# Altium project usb_to_ttl.PrjPcb
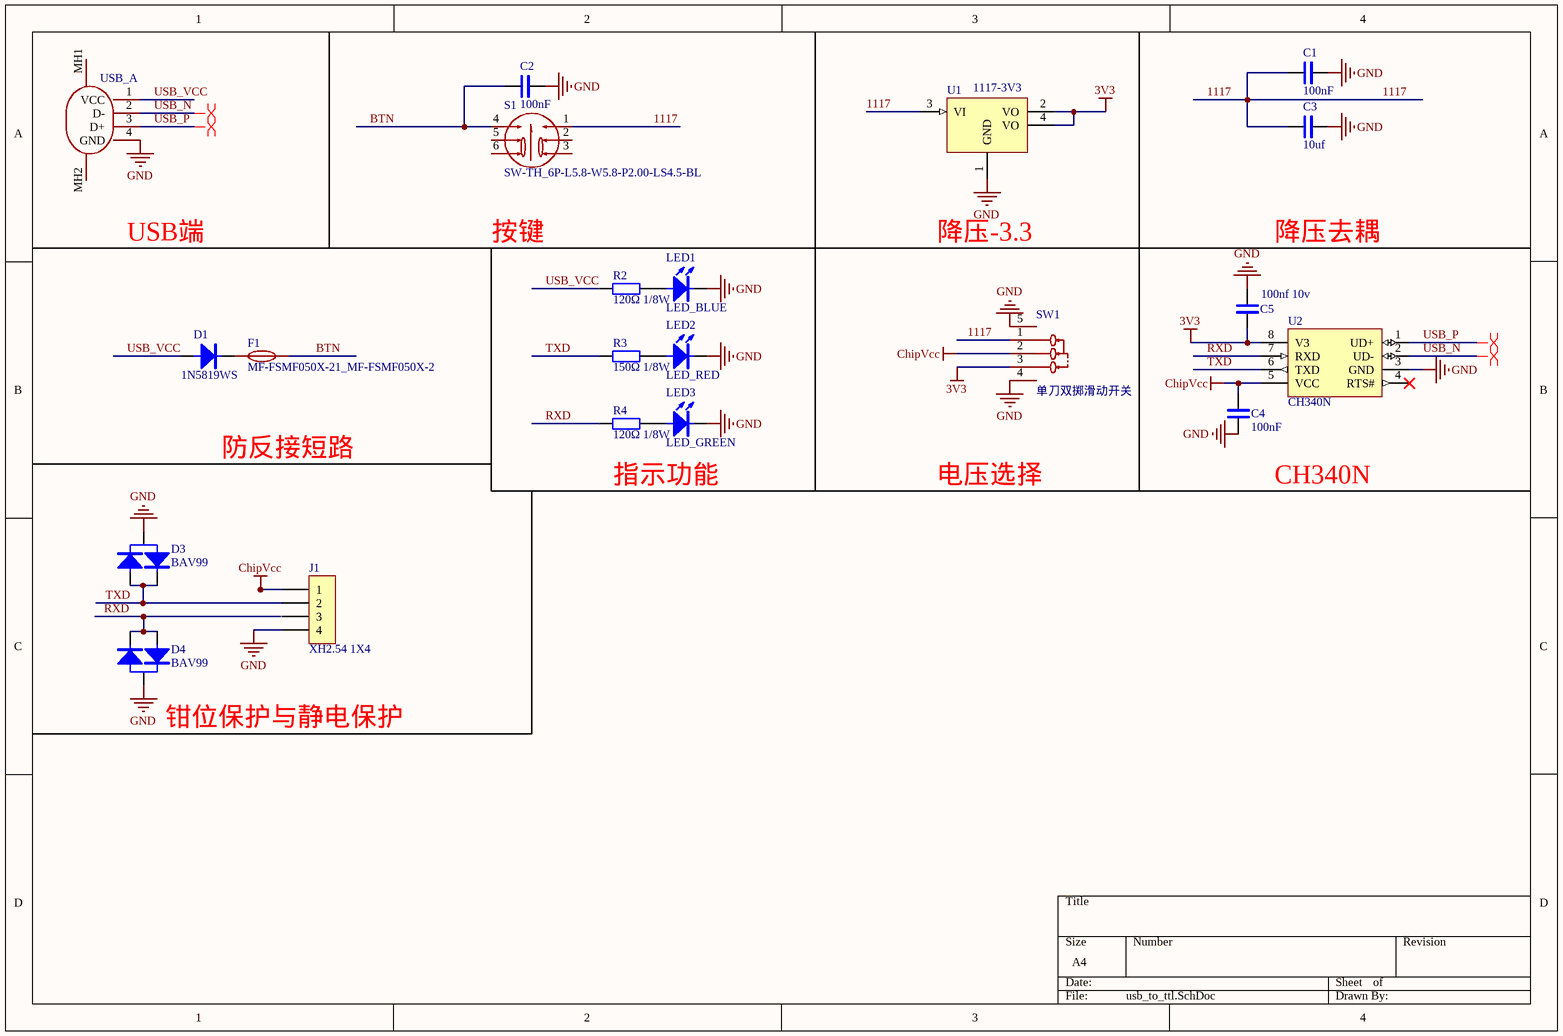
[diagram p0: usb_to_ttl.SchDoc]
1 sheet, 21 parts. Net scope: global (net labels, ports and power ports of the same name join across sheets).
Board file: usb_to_ttl.PcbDoc

## Sheet usb_to_ttl.SchDoc
size A4; SheetNumber: 1; SheetTotal: 1

### Parts
C1  100nF  [CAP-0402]
C2  100nF  [CAP-0402]
C3  10uf  [CAP-0603]
C4  100nF  [CAP-0402]
C5  100nf 10v  [CAP-0402]
D1  1N5819WS  [SOD-323]
D3  BAV99  [SOT-23-3]
D4  BAV99  [SOT-23-3]
F1  MF-FSMF050X-21_MF-FSMF050X-2  [F0603]
J1  XH2.54 1X4  [PIN-4-2.54-1.0]
LED1  LED_BLUE  [LED-D5]
LED2  LED_RED  [LED-0603]
LED3  LED_GREEN  [LED-0603]
R2  120Ω 1/8W  [RES-0805]
R3  150Ω 1/8W  [RES-0805]
R4  120Ω 1/8W  [RES-0805]
S1  SW-TH_6P-L5.8-W5.8-P2.00-LS4.5-BL  [KFC5858-Z]
SW1  单刀双掷滑动开关  [SW-TH_SK12D07VG5-1]
U1  1117-3V3  [SOT-223]
U2  CH340N  [SOP-8]
USB_A  USB 2.0 A 型公头，4 Pin，中间 2 Pin 间距 2.0 mm，两侧 2 Pin 间距 2.54 mm，直插 90° 弯折出线，无前定位柱，短体，兼容 LCSC C404965（首韩 AM90 系列）  [USB-A-TH-C404965]  (value not drawn)

### Nets
3V3: C5.1 SW1.3 U1.2(VO) U1.4(VO) U2.8(V3)
ChipVcc: C4.1 J1.1 SW1.2 U2.5(VCC)
GND: C1.2 C2.2 C3.2 C4.2 C5.2 D3.3(1C2A) D4.3(1C2A) J1.4 LED1.2(C) LED2.2(C) LED3.2(C) SW1.4 SW1.5 U1.1(GND) U2.3(GND) USB_A.4(GND)
1117: C1.1 C3.1 S1.1 SW1.1 U1.3(VI)
BTN: C2.1 F1.2 S1.4
RXD: D4.1(1A) D4.2(2C) R4.2 U2.7(RXD)
TXD: R3.2 U2.6(TXD)
USB_N: U2.2(UD-) USB_A.2(D-)
USB_P: U2.1(UD+) USB_A.3(D+)
USB_VCC: D1.1(A) R2.2 USB_A.1(VCC)
NetD1_2: D1.2(C) F1.1
NetD3_1: D3.1(1A) D3.2(2C) J1.2
NetLED1_1: LED1.1(A) R2.1
NetLED2_1: LED2.1(A) R3.1
NetLED3_1: LED3.1(A) R4.1

Not connected (* = marked no-connect by the designer): J1 3; S1 2 3 5 6; U2 4(RTS#)*; USB_A MH1 MH2

### Layout directives
differential pair: USB_N, USB_P

### Notes on the sheet
- USB端
- 按键
- 降压-3.3
- 降压去耦
- 防反接短路
- 指示功能
- 电压选择
- CH340N
- (near D4) 钳位保护与静电保护
- Labels drawn without touching a wire or pin: TXD

### Library data of the parts
C1-C5 = CAP: Capacitor
D1 = 1N5819
D3 D4 = BAV99: Diode
J1 = XH2.54 1X4: Connector
LED1-LED3 = LED1: 单色发光二极管
R2-R4 = RES: Resistor
S1 = KFC5858-Z
SW1 = SK12D07VG51_SK12D07VG5
U1 = 1117: Linear Regulator
U2 = CH340N: 无TNOW
USB_A = USB_AM90: USB